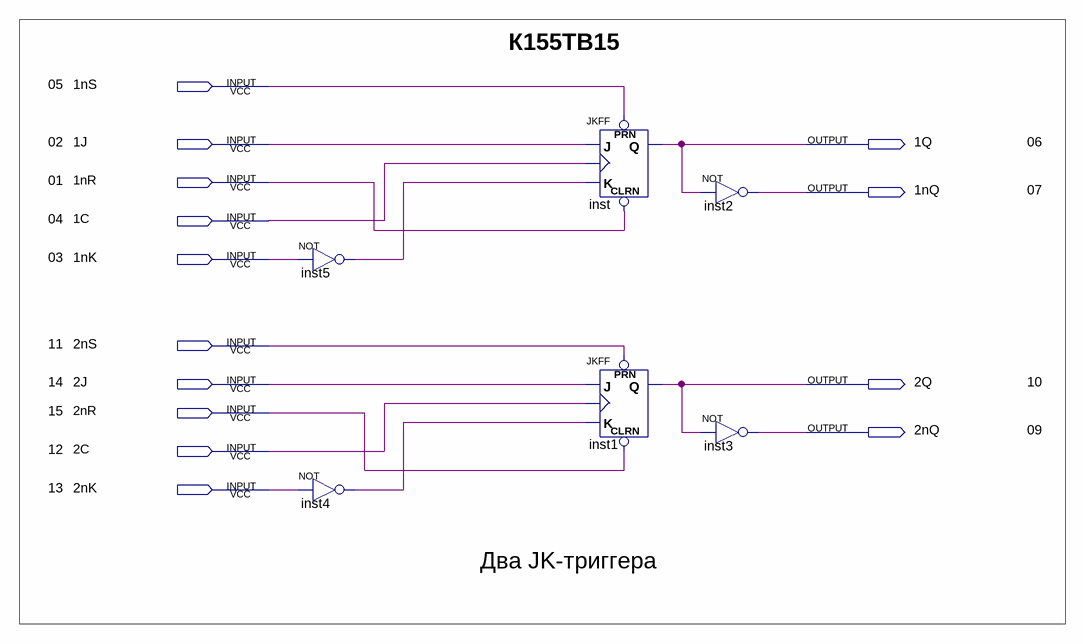
[diagram p0: schematic sheet]
// Quartus schematic K155TB15.bdf as structural Verilog: 6 symbols, 14 pins
module K155TB15 (
  input  \1nS ,
  input  \1J ,
  input  \1nR ,
  input  \1C ,
  input  \1nK ,
  input  \2nS ,
  input  \2J ,
  input  \2nR ,
  input  \2C ,
  input  \2nK ,
  output \1Q ,
  output \1nQ ,
  output \2Q ,
  output \2nQ 
);

  wire inst4_out, inst5_out;

  not inst5 (inst5_out, \1nK );
  not inst4 (inst4_out, \2nK );
  JKFF inst (.PRN(\1nS ), .CLRN(\1nR ), .K(inst5_out), .J(\1J ), .CLK(\1C ), .Q(\1Q ));
  JKFF inst1 (.PRN(\2nS ), .CLRN(\2nR ), .K(inst4_out), .J(\2J ), .CLK(\2C ), .Q(\2Q ));
  not inst2 (\1nQ , \1Q );
  not inst3 (\2nQ , \2Q );

  // Notes on the sheet:
  //   К155ТВ15
  //   05
  //   02
  //   06
  //   01
  //   07
  //   04
  //   03
  //   11
  //   14
  //   10
  //   15
  //   09
  //   12
  //   13
  //   Два JK-триггера
endmodule
